# Altium schematic sheet Sheet-Connectors.SchDoc
size A4; Organization: Altium Limited; Address1: L3, 12a Rodborough Rd; Address2: Frenchs Forest; Address3: NSW; Address4: Australia 2086
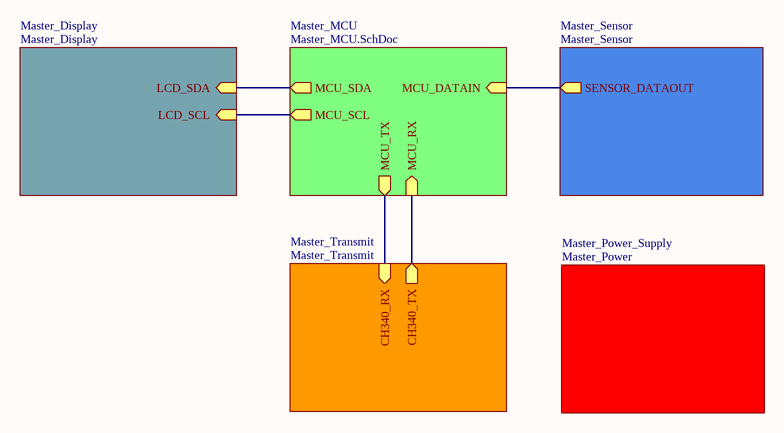
[diagram p0: Sheet-Connectors.SchDoc]

## Sub-sheets
Master_Display = Master_Display: LCD_SDA (in), LCD_SCL (in)
Master_MCU = Master_MCU.SchDoc: MCU_SDA (out), MCU_SCL (out), MCU_DATAIN (in), MCU_TX (out), MCU_RX (in)
Master_Power_Supply = Master_Power: no entries
Master_Sensor = Master_Sensor: SENSOR_DATAOUT (out)
Master_Transmit = Master_Transmit: CH340_TX (out), CH340_RX (in)

## Nets
(unnamed): sheet Master_MCU/MCU_SDA, sheet Master_Display/LCD_SDA
(unnamed): sheet Master_MCU/MCU_SCL, sheet Master_Display/LCD_SCL
(unnamed): sheet Master_MCU/MCU_DATAIN, sheet Master_Sensor/SENSOR_DATAOUT
(unnamed): sheet Master_MCU/MCU_TX, sheet Master_Transmit/CH340_RX
(unnamed): sheet Master_MCU/MCU_RX, sheet Master_Transmit/CH340_TX

## Notes on the sheet
- Labels drawn without touching a wire or pin: Page Contents:, Project:
- Size:
- Date:
- A4
- Ver:
- Time:
- Author:
- Checked by:
- File: